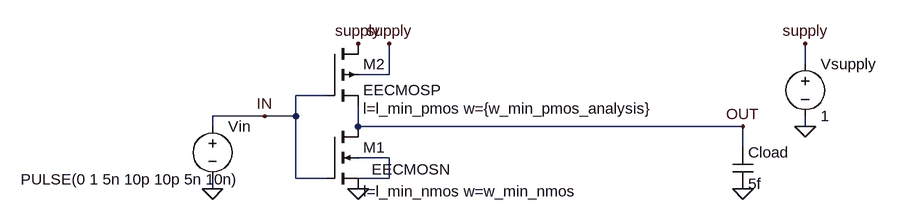
[diagram p0: schematic minimum_inverter_sizing_analysis.asc]
minimum_inverter_sizing_analysis.asc, the LTspice schematic file:
Version 4
SHEET 1 1692 680
WIRE 896 80 896 48
WIRE 256 96 256 48
WIRE 256 96 208 96
WIRE 160 128 112 128
WIRE 64 160 -16 160
WIRE 112 160 112 128
WIRE 112 160 64 160
WIRE -16 176 -16 160
WIRE 208 176 208 144
WIRE 800 176 208 176
WIRE 896 176 896 160
WIRE 208 192 208 176
WIRE 800 208 800 176
WIRE 256 224 208 224
WIRE 112 256 112 160
WIRE 160 256 112 256
WIRE 256 256 256 224
WIRE 256 256 208 256
WIRE -16 272 -16 256
WIRE -16 272 -32 272
FLAG 208 272 0
FLAG 896 176 0
FLAG 800 272 0
FLAG -16 272 0
FLAG 64 160 IN
FLAG 800 176 OUT
FLAG 896 48 supply
FLAG 208 48 supply
FLAG 256 48 supply
SYMBOL nmos4 160 176 R0
WINDOW 3 69 66 Left 2
WINDOW 123 56 100 Left 2
SYMATTR Value EECMOSN
SYMATTR Value2 l=l_min_nmos w=w_min_nmos
SYMATTR InstName M1
SYMBOL cap 784 208 R0
SYMATTR InstName Cload
SYMATTR Value 5f
SYMBOL voltage 896 64 R0
WINDOW 123 0 0 Left 0
WINDOW 39 0 0 Left 0
SYMATTR InstName Vsupply
SYMATTR Value 1
SYMBOL voltage -16 160 R0
WINDOW 3 -295 97 Left 2
WINDOW 123 0 0 Left 0
WINDOW 39 0 0 Left 0
SYMATTR Value PULSE(0 1 5n 10p 10p 5n 10n)
SYMATTR InstName Vin
SYMBOL pmos4 160 48 R0
WINDOW 123 56 100 Left 2
SYMATTR Value2 l=l_min_pmos w={w_min_pmos_analysis}
SYMATTR InstName M2
SYMATTR Value EECMOSP

The netlist it stands for:
* minimum_inverter_sizing_analysis.asc
M1 OUT IN 0 N001 EECMOSN l=l_min_nmos w=w_min_nmos
Cload OUT 0 5f
Vsupply supply 0 1
Vin IN 0 PULSE(0 1 5n 10p 10p 5n 10n)
M2 supply IN OUT supply EECMOSP l=l_min_pmos w={w_min_pmos_analysis}
.model NMOS NMOS
.model PMOS PMOS
.lib standard.mos
.backanno
.end